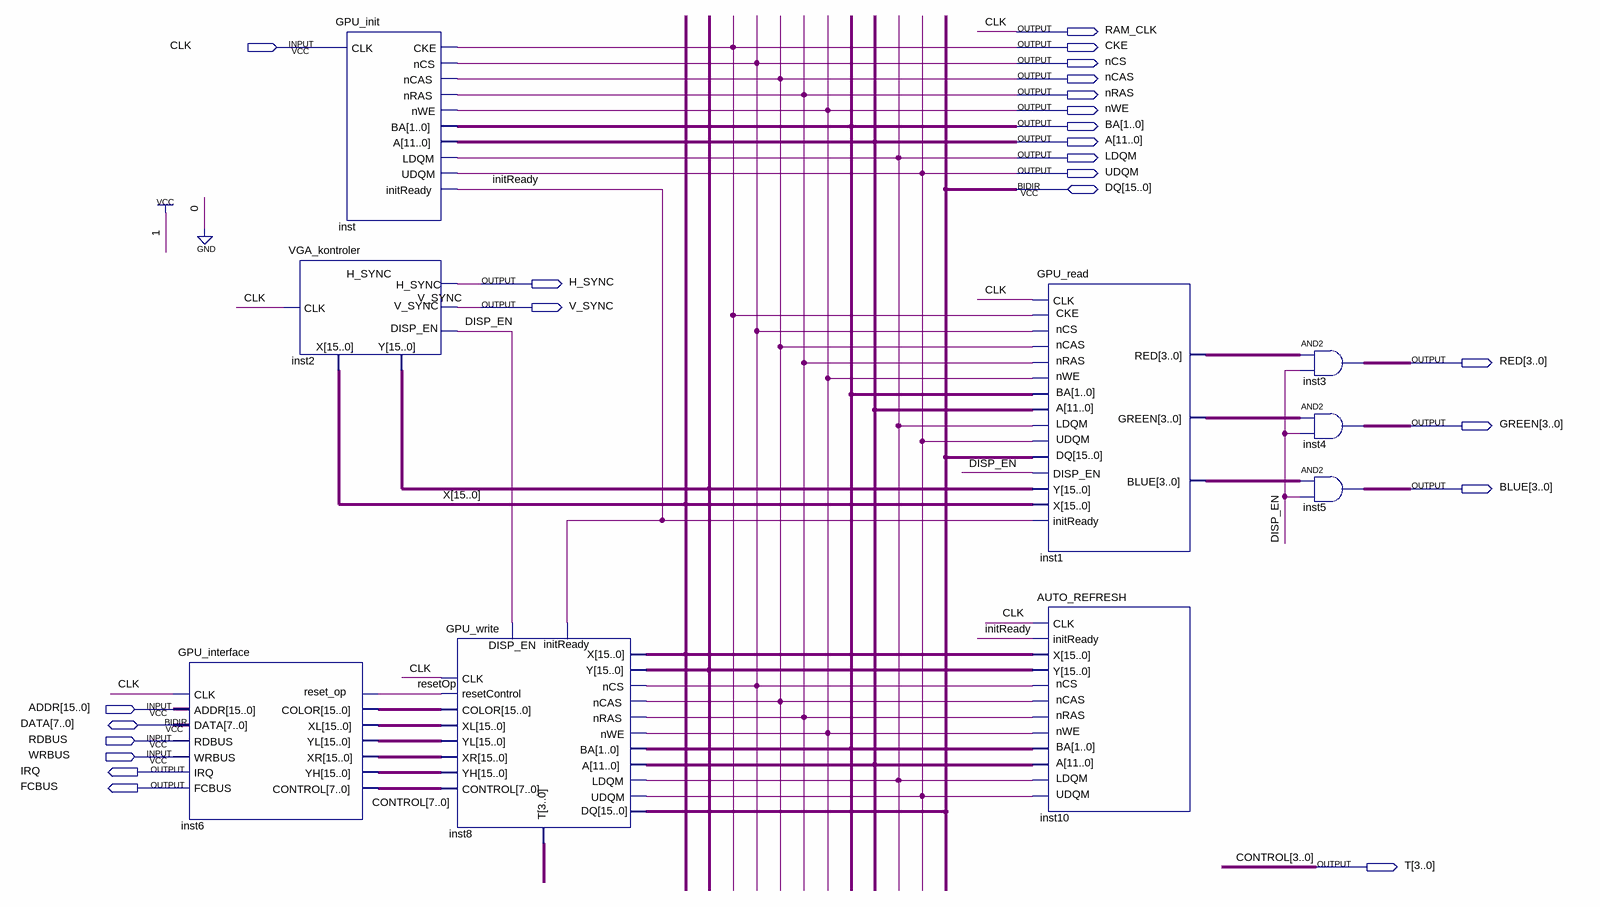
[diagram p0: schematic sheet]
// Quartus schematic GPU.bdf as structural Verilog: 9 symbols, 24 pins
module GPU (
  input  CLK,
  input  [15:0] ADDR,
  input  RDBUS,
  input  WRBUS,
  inout  [15:0] DQ,
  inout  [7:0] DATA,
  output RAM_CLK,
  output CKE,
  output nCS,
  output nCAS,
  output nRAS,
  output nWE,
  output [1:0] BA,
  output [11:0] A,
  output LDQM,
  output UDQM,
  output H_SYNC,
  output V_SYNC,
  output [3:0] RED,
  output [3:0] GREEN,
  output [3:0] BLUE,
  output IRQ,
  output FCBUS,
  output [3:0] T
);

  wire DISP_EN, initReady, resetOp;
  wire [3:0] inst1_blue, inst1_green, inst1_red, inst8_t;
  wire [7:4] CONTROL;
  wire [15:0] inst2_y, inst6_color, inst6_xl, inst6_xr, inst6_yh, inst6_yl, X;

  GPU_interface inst6 (
    .CLK(CLK), .ADDR(ADDR), .RDBUS(RDBUS), .WRBUS(WRBUS), .reset_op(resetOp), .IRQ(IRQ), .FCBUS(FCBUS),
    .COLOR(inst6_color), .XL(inst6_xl), .YL(inst6_yl), .XR(inst6_xr), .YH(inst6_yh), .CONTROL({CONTROL, T}),
    .DATA(DATA));
  GPU_init inst (
    .CLK(CLK), .CKE(CKE), .nCS(nCS), .nCAS(nCAS), .nRAS(nRAS), .nWE(nWE), .BA(BA), .A(A), .LDQM(LDQM),
    .UDQM(UDQM), .initReady(initReady));
  VGA_kontroler inst2 (.CLK(CLK), .X(X), .Y(inst2_y), .H_SYNC(H_SYNC), .V_SYNC(V_SYNC), .DISP_EN(DISP_EN));
  GPU_write inst8 (
    .CLK(CLK), .COLOR(inst6_color), .XL(inst6_xl), .YL(inst6_yl), .XR(inst6_xr), .YH(inst6_yh),
    .CONTROL({CONTROL, T}), .DISP_EN(DISP_EN), .X(X), .Y(inst2_y), .initReady(initReady), .nCS(nCS),
    .nCAS(nCAS), .nRAS(nRAS), .nWE(nWE), .BA(BA), .A(A), .LDQM(LDQM), .UDQM(UDQM), .T(inst8_t),
    .resetControl(resetOp), .DQ(DQ));
  GPU_read inst1 (
    .CLK(CLK), .initReady(initReady), .X(X), .Y(inst2_y), .DISP_EN(DISP_EN), .RED(inst1_red),
    .GREEN(inst1_green), .BLUE(inst1_blue), .CKE(CKE), .nCS(nCS), .nCAS(nCAS), .nRAS(nRAS), .nWE(nWE),
    .BA(BA), .LDQM(LDQM), .UDQM(UDQM), .A(A), .DQ(DQ));
  AUTO_REFRESH inst10 (
    .CLK(CLK), .initReady(initReady), .X(X), .Y(inst2_y), .nCS(nCS), .nCAS(nCAS), .nRAS(nRAS), .nWE(nWE),
    .BA(BA), .A(A), .LDQM(LDQM), .UDQM(UDQM));
  assign RED = inst1_red & {4{DISP_EN}};  // AND2 inst3, 4 bits wide
  assign GREEN = inst1_green & {4{DISP_EN}};  // AND2 inst4, 4 bits wide
  assign BLUE = inst1_blue & {4{DISP_EN}};  // AND2 inst5, 4 bits wide

  assign RAM_CLK = CLK;

  // Other names for the same wires on the sheet: CONTROL[3:0] = T
endmodule
